# EAGLE schematic Dionysus v1 (EAGLE 7.4.0)
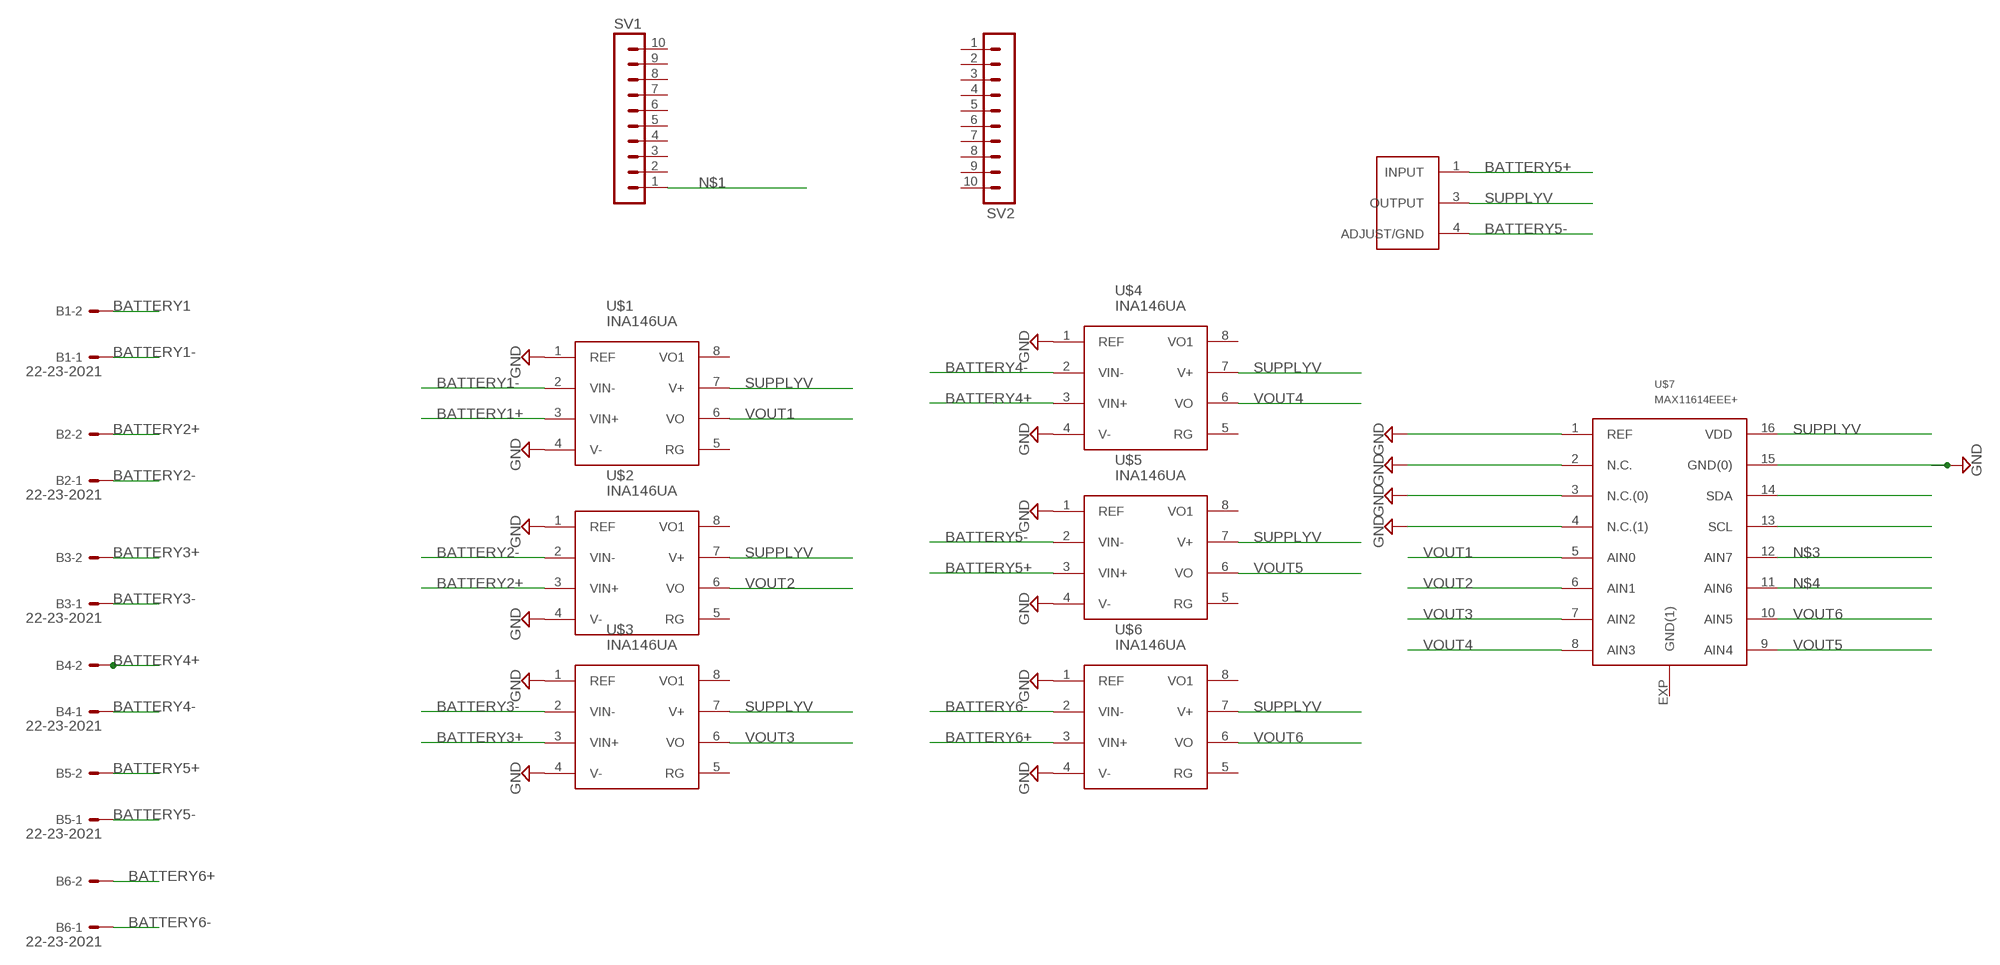
[diagram p0: schematic, sheet 1]

## Parts
B1  22-23-2021  [22-23-2021]
B2  22-23-2021  [22-23-2021]
B3  22-23-2021  [22-23-2021]
B4  22-23-2021  [22-23-2021]
B5  22-23-2021  [22-23-2021]
B6  22-23-2021  [22-23-2021]
SV1  MA10-1  [MA10-1]
SV2  MA10-1  [MA10-1]
U$1  INA146  [SO-8]
U$2  INA146  [SO-8]
U$3  INA146  [SO-8]
U$4  INA146  [SO-8]
U$5  INA146  [SO-8]
U$6  INA146  [SO-8]
U$7  MAX11614  [QSOP16]
U$8  DPAK  [DPAK]

## Nets
BATTERY1: B1.2
BATTERY1+: U$1.3(VIN+)
BATTERY1-: B1.1 U$1.2(VIN-)
BATTERY2+: B2.2 U$2.3(VIN+)
BATTERY2-: B2.1 U$2.2(VIN-)
BATTERY3+: B3.2 U$3.3(VIN+)
BATTERY3-: B3.1 U$3.2(VIN-)
BATTERY4+: B4.2
BATTERY4-: B4.1
BATTERY5+: B5.2 U$8.1(INPUT)
BATTERY5-: B5.1
BATTERY6+: B6.2
BATTERY6-: B6.1
GND: U$1.1(REF) U$1.4(V-) U$2.1(REF) U$2.4(V-) U$3.1(REF) U$3.4(V-) U$4.1(REF) U$4.4(V-) U$5.1(REF) U$5.4(V-) U$6.1(REF) U$6.4(V-) U$7.1(REF)
N$1: SV1.1
SUPPLYV: U$1.7(V+)
Unconnected: SV1.2 SV1.3 SV1.4 SV1.5 SV1.6 SV1.7 SV1.8 SV1.9 SV1.10 SV2.1 SV2.2 SV2.3 SV2.4 SV2.5 SV2.6 SV2.7 SV2.8 SV2.9 SV2.10 U$1.5(RG) U$1.6(VO) U$1.8(VO1) U$2.5(RG) U$2.6(VO) U$2.7(V+) U$2.8(VO1) U$3.5(RG) U$3.6(VO) U$3.7(V+) U$3.8(VO1) U$4.2(VIN-) U$4.3(VIN+) U$4.5(RG) U$4.6(VO) U$4.7(V+) U$4.8(VO1) U$5.2(VIN-) U$5.3(VIN+) U$5.5(RG) U$5.6(VO) U$5.7(V+) U$5.8(VO1) U$6.2(VIN-) U$6.3(VIN+) U$6.5(RG) U$6.6(VO) U$6.7(V+) U$6.8(VO1) U$7.2(N.C.) U$7.3(N.C.(0)) U$7.4(N.C.(1)) U$7.5(AIN0) U$7.6(AIN1) U$7.7(AIN2) U$7.8(AIN3) U$7.9(AIN4) U$7.10(AIN5) U$7.11(AIN6) U$7.12(AIN7) U$7.13(SCL) U$7.14(SDA) U$7.15(GND(0)) U$7.16(VDD) U$7.EXP(GND(1)) U$8.3(OUTPUT) U$8.4(ADJUST/GND)

## Library data of the parts
B1-B6 = con-molex:22-23-2021: .100" (2.54mm) Center Header - 2 Pin; MF: MOLEX; MPN: 22-23-2021; OC_FARNELL: 1462926; OC_NEWARK: 25C3832
SV1 SV2 = con-lstb:MA10-1: PIN HEADER; OC_FARNELL: unknown; OC_NEWARK: unknown
U$1-U$6 = INA146:INA146; DIGI: INA146UA-ND
U$7 = MAX11614:MAX11614; MAX11614: MAX11614EEE+-ND
U$8 = NCP1117:DPAK